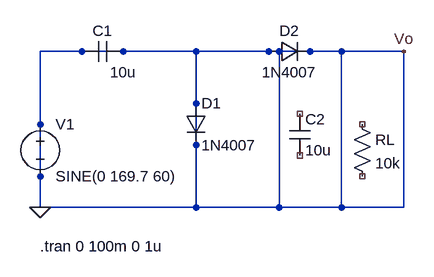
[diagram p0: schematic 04_circuit_generated-by-claude-sonnet-4-6.asc]
04_circuit_generated-by-claude-sonnet-4-6.asc, the LTspice schematic file:
Version 4
SHEET 1 880 680
WIRE 80 160 80 400
WIRE 80 160 192 160
WIRE 80 400 640 400
WIRE 192 160 320 160
WIRE 320 160 320 240
WIRE 320 240 320 400
WIRE 320 160 448 160
WIRE 448 160 448 400
WIRE 448 160 544 160
WIRE 544 160 544 400
WIRE 640 160 640 400
WIRE 544 160 640 160
FLAG 80 400 0
FLAG 640 160 Vo
SYMBOL voltage 80 256 R0
SYMATTR InstName V1
SYMATTR Value SINE(0 169.7 60)
SYMBOL cap 208 144 R90
WINDOW 0 0 32 VBottom 2
WINDOW 3 32 0 VTop 2
SYMATTR InstName C1
SYMATTR Value 10u
SYMBOL diode 304 240 R0
SYMATTR InstName D1
SYMATTR Value 1N4007
SYMBOL diode 432 176 R270
WINDOW 0 32 32 VTop 2
WINDOW 3 0 32 VBottom 2
SYMATTR InstName D2
SYMATTR Value 1N4007
SYMBOL cap 464 256 R0
SYMATTR InstName C2
SYMATTR Value 10u
SYMBOL res 560 256 R0
SYMATTR InstName RL
SYMATTR Value 10k
TEXT 80 460 Left 2 !.tran 0 100m 0 1u

The netlist it stands for:
* 04_circuit_generated-by-claude-sonnet-4-6.asc
V1 0 0 SINE(0 169.7 60)
C1 0 0 10u
D1 0 0 1N4007
D2 0 0 1N4007
C2 NC_01 NC_02 10u
RL NC_03 NC_04 10k
.model D D
.lib standard.dio
.tran 0 100m 0 1u
.backanno
.end